# Altium project WIZ750SR.PrjPcb
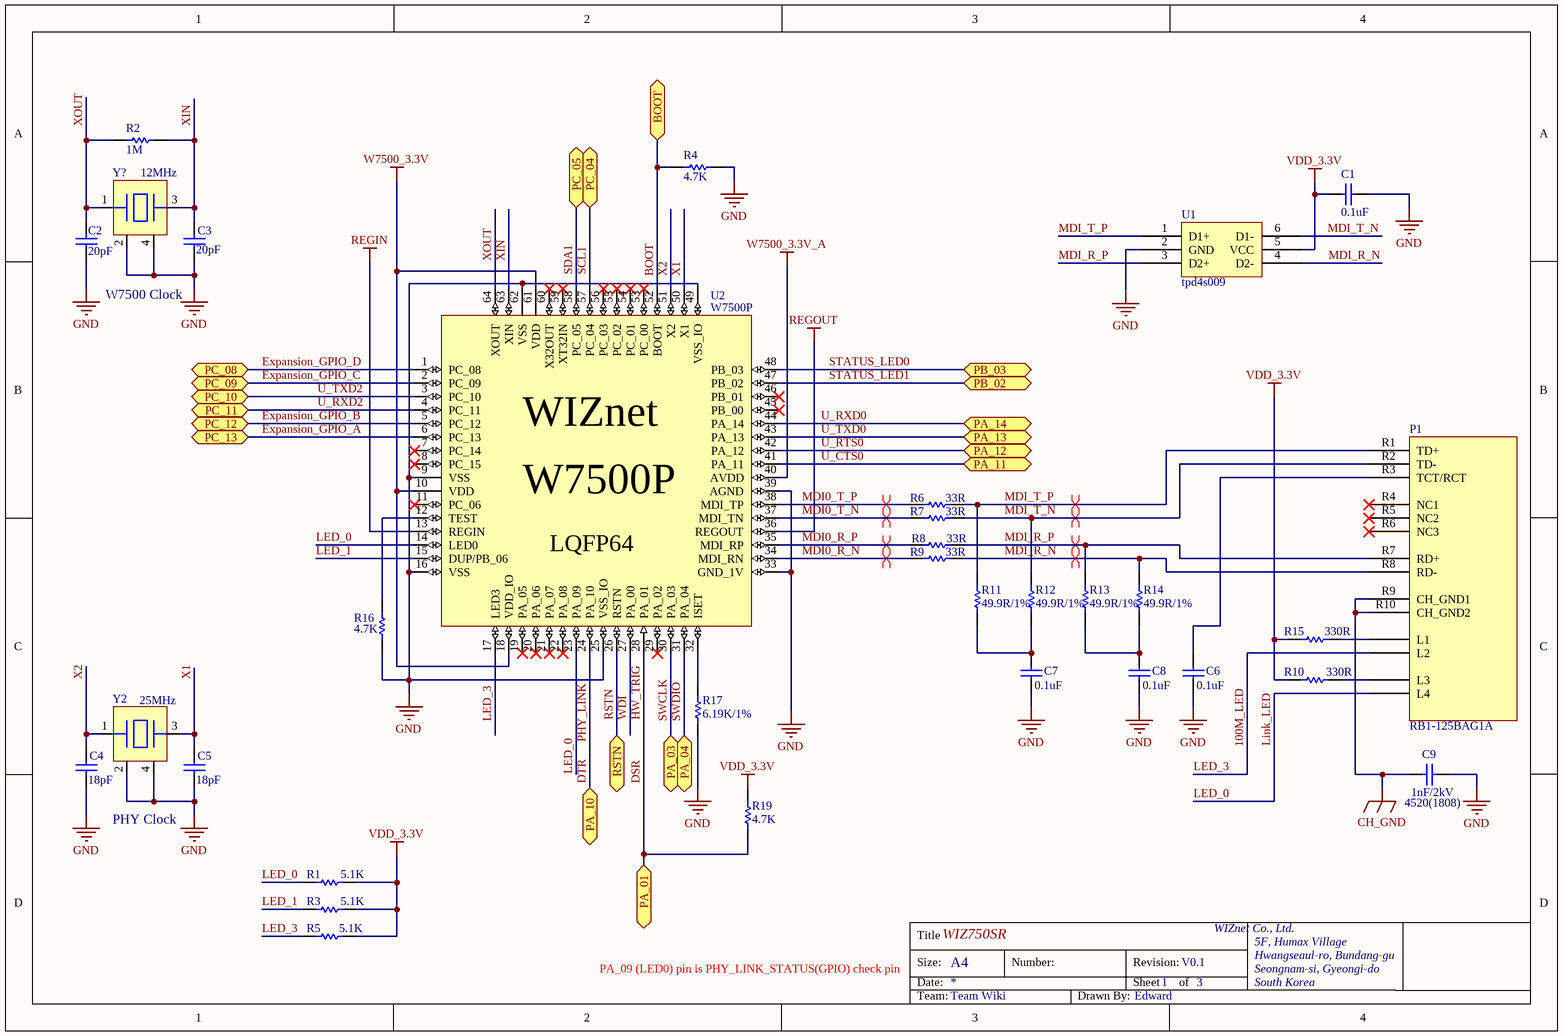
[diagram p0: 1.WIZ750SR_W7500P.SchDoc]
1 sheet, 32 parts. Net scope: flat (ports and power ports of the same name join across sheets).

## Sheet 1.WIZ750SR_W7500P.SchDoc
size A4; DrawnBy: Peter; Organization: WIZnet Co., Ltd.; Address1: 5F, Humax Village; Address2: Hwangseaul-ro, Bundang-Gu; Address3: Seongnam-Si, Gyeonggi-Do; Address4: South Korea; Team: Wiki

### Parts
C1  0.1uF  [CAP-0402]
C2  20pF  [CAP-0402]
C3  20pF  [CAP-0402]
C4  18pF  [CAP-0402]
C5  18pF  [CAP-0402]
C6  0.1uF  [CAP-0402]
C7  0.1uF  [CAP-0402]
C8  0.1uF  [CAP-0402]
C9  1nF/2kV  [CAP-1808]
P1  RB1-125BAG1A
R1  5.1K  [RES-0402]
R2  1M  [RES-0402]
R3  5.1K  [RES-0402]
R4  4.7K  [RES-0402]
R5  5.1K  [RES-0402]
R6  33R  [RES-0402]
R7  33R  [RES-0402]
R8  33R  [RES-0402]
R9  33R  [RES-0402]
R10  330R  [RES-0402]
R11  49.9R/1%  [RES-0402]
R12  49.9R/1%  [RES-0402]
R13  49.9R/1%  [RES-0402]
R14  49.9R/1%  [RES-0402]
R15  330R  [RES-0402]
R16  4.7K  [RES-0402]
R17  6.19K/1%  [RES-0402]
R19  4.7K  [RES-0402]
U1  tpd4s009  [SOT-23-6L]
U2  W7500P  [W7500-LQFP64]
Y2  25MHz  [OSC-82J0626]
Y?  12MHz  [OSC-TZ1067B]

### Ports
BOOT, PA_01, PA_03, PA_04, PA_10, PA_11, PA_12, PA_13, PA_14, PB_02, PB_03, PC_04, PC_05, PC_08, PC_09, PC_10, PC_11, PC_12, PC_13, RSTN

### Nets
CH_GND: C9.2 P1.R9(CH_GND1) P1.R10(CH_GND2)
GND: C1.1 C2.1 C3.1 C4.1 C5.1 C6.1 C7.1 C8.1 C9.1 R4.1 R16.1 R17.1 U1.2(GND) U2.9(VSS) U2.16(VSS) U2.25(VSS_IO) U2.33(GND_1V) U2.39(AGND) U2.49(VSS_IO) U2.62(VSS) Y2.2 Y2.4 Y?.2 Y?.4
REGIN: U2.13(REGIN)
REGOUT: U2.36(REGOUT)
VDD_3.3V: C1.2 R1.2 R3.2 R5.2 R10.1 R15.1 R19.1 U1.5(VCC)
W7500_3.3V: U2.10(VDD) U2.18(VDD_IO) U2.61(VDD)
W7500_3.3V_A: U2.40(AVDD)
100M_LED: P1.?3(L2) R5.1 U2.17(LED3)  [also labelled LED_3]
BOOT: R4.2 U2.52(BOOT) ; port BOOT
DSR: R19.2 U2.28(PA_01) ; port PA_01  [also labelled HW_TRIG]
DTR: U2.24(PA_10) ; port PA_10  [also labelled PHY_LINK]
Expansion_GPIO_A: U2.6(PC_13) ; port PC_13
Expansion_GPIO_B: U2.5(PC_12) ; port PC_12
Expansion_GPIO_C: U2.2(PC_09) ; port PC_09
Expansion_GPIO_D: U2.1(PC_08) ; port PC_08
LED_0: P1.?1(L4) R1.1 U2.14(LED0) U2.23(PA_09)  [also labelled Link_LED]
LED_1: R3.1 U2.15(DUP/PB_06)
MDI0_R_N: R9.1 U2.34(MDI_RN)
MDI0_R_P: R8.1 U2.35(MDI_RP)
MDI0_T_N: R7.1 U2.37(MDI_TN)
MDI0_T_P: R6.1 U2.38(MDI_TP)
MDI_R_N: P1.R8(RD-) R9.2 R14.2 U1.4(D2-)
MDI_R_P: P1.R7(RD+) R8.2 R13.2 U1.3(D2+)
MDI_T_N: P1.R2(TD-) R7.2 R12.2 U1.6(D1-)
MDI_T_P: P1.R1(TD+) R6.2 R11.2 U1.1(D1+)
RSTN: U2.26(RSTN) ; port RSTN
SCL1: U2.57(PC_04) ; port PC_04
SDA1: U2.58(PC_05) ; port PC_05
STATUS_LED0: U2.48(PB_03) ; port PB_03
STATUS_LED1: U2.47(PB_02) ; port PB_02
SWCLK: U2.30(PA_03) ; port PA_03
SWDIO: U2.31(PA_04) ; port PA_04
U_CTS0: U2.41(PA_11) ; port PA_11
U_RTS0: U2.42(PA_12) ; port PA_12
U_RXD0: U2.44(PA_14) ; port PA_14
U_RXD2: U2.4(PC_11) ; port PC_11
U_TXD0: U2.43(PA_13) ; port PA_13
U_TXD2: U2.3(PC_10) ; port PC_10
WDI: U2.27(PA_00)
X1: C5.2 U2.50(X1) Y2.3
X2: C4.2 U2.51(X2) Y2.1
XIN: C3.2 R2.2 U2.63(XIN) Y?.3
XOUT: C2.2 R2.1 U2.64(XOUT) Y?.1
NetC6_2: C6.2 P1.R3(TCT/RCT)
NetC7_2: C7.2 R11.1 R12.1
NetC8_2: C8.2 R13.1 R14.1
NetP1_?2: P1.?2(L3) R10.2
NetP1_?4: P1.?4(L1) R15.2
NetR16_2: R16.2 U2.12(TEST)
NetR17_2: R17.2 U2.32(ISET)

Not connected (* = marked no-connect by the designer): P1 R4(NC1)* R5(NC2)* R6(NC3)*; U2 7(PC_14)* 8(PC_15)* 11(PC_06)* 19(PA_05)* 20(PA_06)* 21(PA_07)* 22(PA_08)* 29(PA_02)* 45(PB_00)* 46(PB_01)* 53(PC_00)* 54(PC_01)* 55(PC_02)* 56(PC_03)* 59(XT32IN)* 60(X32OUT)*

### Layout directives
differential pair: MDI0_R_N, MDI0_R_P, MDI0_T_N, MDI0_T_P, MDI_R_N, MDI_R_P, MDI_T_N, MDI_T_P

### Notes on the sheet
- W7500 Clock
- PHY Clock
- (near C9) 4520(1808)
- PA_09 (LED0) pin is PHY_LINK_STATUS(GPIO) check pin
- Title
- Size:
- Date:
- WIZ750SR
- A4
- Number:
- Revision:
- Sheet
- 1
- of
- V0.1
- 3
- WIZnet Co., Ltd.
- 5F, Humax Village
- Hwangseaul-ro, Bundang-gu
- Seongnam-si, Gyeongi-do
- South Korea
- Team:
- Team Wiki
- Drawn By:
- Edward
- (in symbol W7500P) WIZnet; LQFP64

### Library data of the parts
C1-C8 = CAP-0402: Ceramic CAP 0402(1005)
C9 = CAP-1808: Ceramic CAP 1808(4520)
P1 = RD1-125BAG1A: MAGJACK UDE
R1-R17 R19 = RES-0402
U1 = tpd4s009: 6-PIN SOT DBVor DCK Package
U2 = W7500P: WIZnet ARM Cortex-M0, Add PHY
Y2 = OSC-82J0626-25MHz: X-tal 25MHz,3.2x2.5 SMD, CL=18pF
Y? = OSC-TZ1067B-12MHz: X-tal 12MHz,3.2x2.5 SMD, CL=20pF